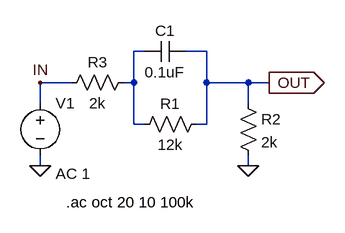
[diagram p0: schematic zero1.asc]
zero1.asc, the LTspice schematic file:
Version 4
SHEET 1 880 680
WIRE 224 32 208 32
WIRE 320 32 288 32
WIRE 112 80 64 80
WIRE 208 80 208 32
WIRE 208 80 192 80
WIRE 320 80 320 32
WIRE 384 80 320 80
WIRE 416 80 384 80
WIRE 64 112 64 80
WIRE 384 112 384 80
WIRE 208 144 208 80
WIRE 224 144 208 144
WIRE 320 144 320 80
WIRE 320 144 304 144
WIRE 64 208 64 192
WIRE 384 208 384 192
FLAG 64 208 0
FLAG 416 80 OUT
IOPIN 416 80 Out
FLAG 64 80 IN
FLAG 384 208 0
SYMBOL res 320 128 R90
WINDOW 0 0 56 VBottom 2
WINDOW 3 32 56 VTop 2
SYMATTR InstName R1
SYMATTR Value 12k
SYMBOL cap 288 16 R90
WINDOW 0 0 32 VBottom 2
WINDOW 3 32 32 VTop 2
SYMATTR InstName C1
SYMATTR Value 0.1uF
SYMBOL voltage 64 96 R0
WINDOW 123 24 124 Left 2
WINDOW 39 0 0 Left 2
SYMATTR Value2 AC 1
SYMATTR InstName V1
SYMATTR Value ""
SYMBOL res 368 96 R0
SYMATTR InstName R2
SYMATTR Value 2k
SYMBOL res 208 64 R90
WINDOW 0 0 56 VBottom 2
WINDOW 3 32 56 VTop 2
SYMATTR InstName R3
SYMATTR Value 2k
TEXT 104 264 Left 2 !.ac oct 20 10 100k

The netlist it stands for:
* zero1.asc
R1 OUT N001 12k
C1 OUT N001 0.1uF
V1 IN 0 AC 1
R2 OUT 0 2k
R3 N001 IN 2k
.ac oct 20 10 100k
.backanno
.end